# EAGLE design board_0.8v (EAGLE 7.7.0)
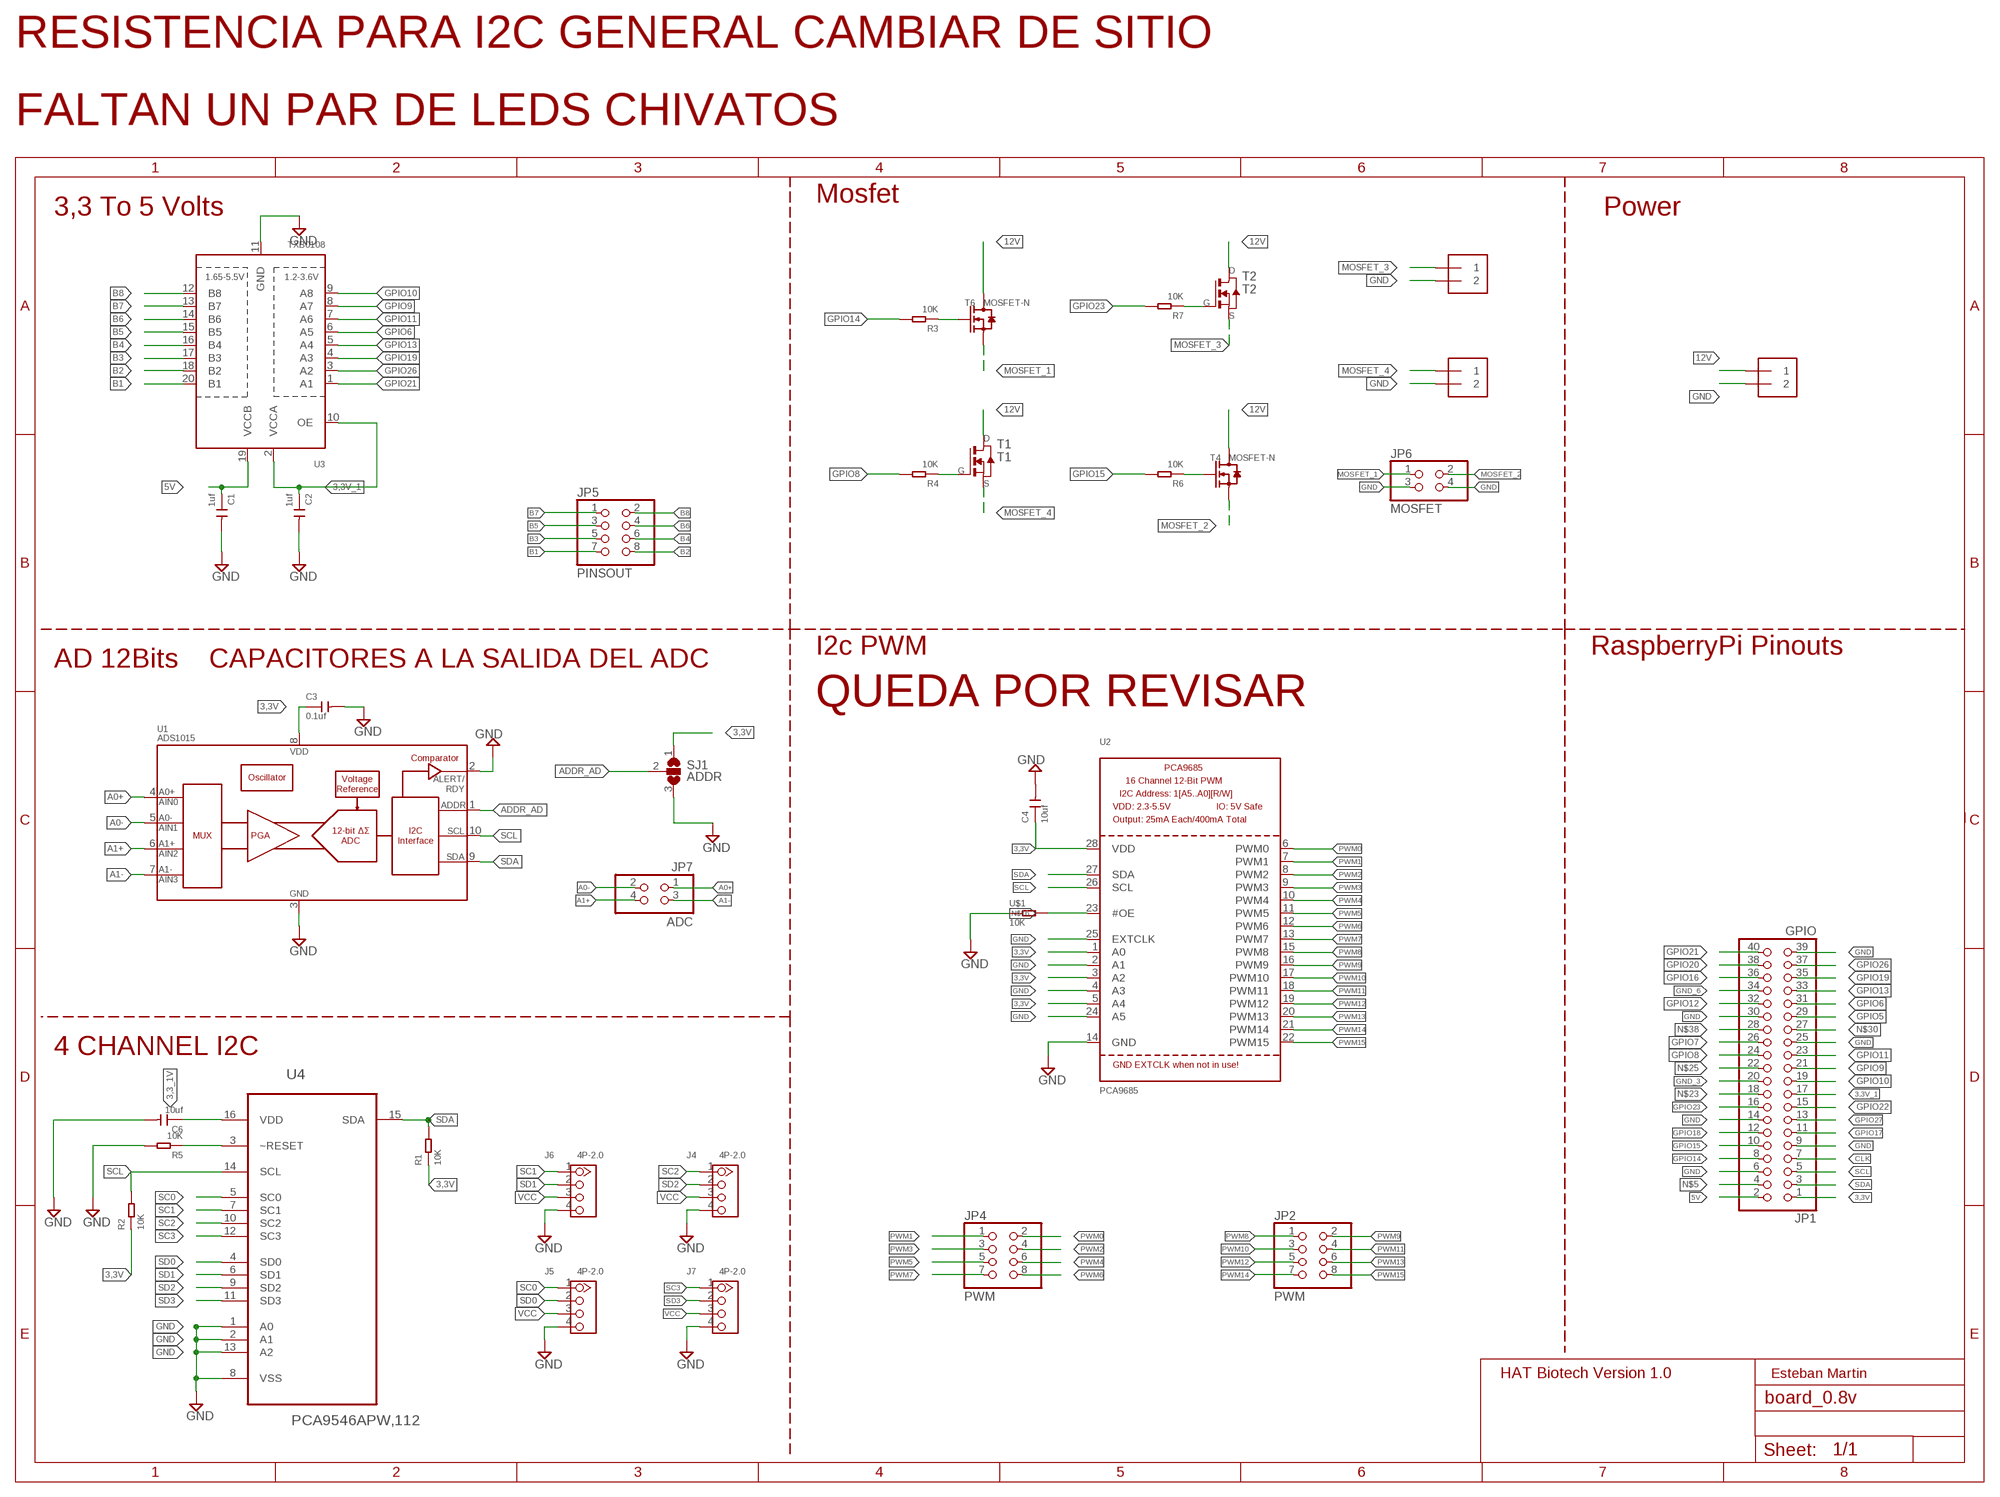
[diagram p0: schematic, sheet 1]

## Parts
C1  1uf  CERAMIC-1UF-25V-10%-X7R(0805)  [C0805]
C2  1uf  CERAMIC-1UF-25V-10%-X7R(0805)  [C0805]
C3  0.1uf  CERAMIC-1UF-25V-10%-X7R(0805)  [C0805]
C4  10uf  CERAMIC-1UF-25V-10%-X7R(0805)  [C0805]
C6  10uf  CERAMIC-1UF-25V-10%-X7R(0805)  [C0805]
J1  1X2-3.5MM  [1X2-3.5MM]
J2  1X2-3.5MM  [1X2-3.5MM]
J3  1X2-3.5MM  [1X2-3.5MM]
J4  4P-2.0  GROVE-CONNECTOR-DIP(4P-2.0)  [HW4-2.0]
J5  4P-2.0  GROVE-CONNECTOR-DIP(4P-2.0)  [HW4-2.0]
J6  4P-2.0  GROVE-CONNECTOR-DIP(4P-2.0)  [HW4-2.0]
J7  4P-2.0  GROVE-CONNECTOR-DIP(4P-2.0)  [HW4-2.0]
JP1  GPIO  PINHD-2X20  [2X20]
JP2  PWM  PINHD-2X4  [2X04]
JP4  PWM  PINHD-2X4  [2X04]
JP5  PINSOUT  PINHD-2X4  [2X04]
JP6  MOSFET  PINHD-2X2  [2X02]
JP7  ADC  PINHD-2X2  [2X02]
R1  10K  SMD-RES-10K-1%-1/8W(0805)  [R0805]
R2  10K  SMD-RES-10K-1%-1/8W(0805)  [R0805]
R3  10K  SMD-RES-10K-1%-1/8W(0805)  [R0805]
R4  10K  SMD-RES-10K-1%-1/8W(0805)  [R0805]
R5  10K  SMD-RES-10K-1%-1/8W(0805)  [R0805]
R6  10K  SMD-RES-10K-1%-1/8W(0805)  [R0805]
R7  10K  SMD-RES-10K-1%-1/8W(0805)  [R0805]
SJ1  ADDR  SJ2W  [SJ_2]
T1  T1  NMOSFETTO252  [TO252]
T2  T2  NMOSFETTO252  [TO252]
T4  MOSFET-N  [SOT-23]
T6  MOSFET-N  [SOT-23]
U1  ADS1015  [MSOP10]
U2  PCA9685  [TSSOP28]
U3  TXB0108  TXB0108PWR  [TSSOP20]
U4  PCA9546APW,112  [SOP65P640X110-16N]
U$1  10K  SMD-RES-10K-1%-1/8W(0805)  [R0805]

## Nets
3,3_1V: C6.1 U4.16(VDD)
3,3V: C3.1 C4.1 JP1.1 R1.1 R2.1 SJ1.1 U1.8(VDD) U2.1(A0) U2.3(A2) U2.5(A4) U2.28(VDD)
3,3V_1: C2.1 JP1.17 U3.2(VCCA) U3.10(OE)
5V: C1.1 JP1.2 U3.19(VCCB)
12V: J2.1 T1.3(D) T2.3(D) T4.3(D) T6.3(D)
A0+: JP7.1 U1.4(AIN0)
A0-: JP7.2 U1.5(AIN1)
A1+: JP7.4 U1.6(AIN2)
A1-: JP7.3 U1.7(AIN3)
ADDR_AD: SJ1.2 U1.1(ADDR)
B1: JP5.7 U3.20(B1)
B2: JP5.8 U3.18(B2)
B3: JP5.5 U3.17(B3)
B4: JP5.6 U3.16(B4)
B5: JP5.3 U3.15(B5)
B6: JP5.4 U3.14(B6)
B7: JP5.1 U3.13(B7)
B8: JP5.2 U3.12(B8)
CLK: JP1.7
GND: C1.2 C2.2 C3.2 C4.2 C6.2 J1.2 J2.2 J3.2 J4.4 J5.4 J6.4 J7.4 JP1.6 JP1.9 JP1.14 JP1.25 JP1.30 JP1.39 JP6.3 JP6.4 R5.2 SJ1.3 U1.2(ALERT/RDY) U1.3(VSS) U2.2(A1) U2.4(A3) U2.14(GND) U2.24(A5) U2.25(EXTCLK) U3.11(GND) U4.1(A0) U4.2(A1) U4.8(VSS) U4.13(A2) U$1.1
GND_3: JP1.20
GND_6: JP1.34
GPIO5: JP1.29
GPIO6: JP1.31 U3.6(A5)
GPIO7: JP1.26
GPIO8: JP1.24 R4.2
GPIO9: JP1.21 U3.8(A7)
GPIO10: JP1.19 U3.9(A8)
GPIO11: JP1.23 U3.7(A6)
GPIO12: JP1.32
GPIO13: JP1.33 U3.5(A4)
GPIO14: JP1.8 R3.2
GPIO15: JP1.10 R6.2
GPIO16: JP1.36
GPIO17: JP1.11
GPIO18: JP1.12
GPIO19: JP1.35 U3.4(A3)
GPIO20: JP1.38
GPIO21: JP1.40 U3.1(A1)
GPIO22: JP1.15
GPIO23: JP1.16 R7.2
GPIO26: JP1.37 U3.3(A2)
GPIO27: JP1.13
MOSFET_1: JP6.1 T6.2(S)
MOSFET_2: JP6.2 T4.2(S)
MOSFET_3: J1.1 T2.2(S)
MOSFET_4: J3.1 T1.2(S)
N$5: JP1.4
N$6: R3.1 T6.1(G)
N$7: R5.1 U4.3(~RESET)
N$9: R4.1 T1.1(G)
N$10: R6.1 T4.1(G)
N$11: R7.1 T2.1(G)
N$16: U2.23(#OE) U$1.2
N$23: JP1.18
N$25: JP1.22
N$30: JP1.27
N$38: JP1.28
PWM0: JP4.2 U2.6(PWM0)
PWM1: JP4.1 U2.7(PWM1)
PWM2: JP4.4 U2.8(PWM2)
PWM3: JP4.3 U2.9(PWM3)
PWM4: JP4.6 U2.10(PWM4)
PWM5: JP4.5 U2.11(PWM5)
PWM6: JP4.8 U2.12(PWM6)
PWM7: JP4.7 U2.13(PWM7)
PWM8: JP2.1 U2.15(PWM8)
PWM9: JP2.2 U2.16(PWM9)
PWM10: JP2.3 U2.17(PWM10)
PWM11: JP2.4 U2.18(PWM11)
PWM12: JP2.5 U2.19(PWM12)
PWM13: JP2.6 U2.20(PWM13)
PWM14: JP2.7 U2.21(PWM14)
PWM15: JP2.8 U2.22(PWM15)
SC0: J5.1 U4.5(SC0)
SC1: J6.1 U4.7(SC1)
SC2: J4.1 U4.10(SC2)
SC3: J7.1 U4.12(SC3)
SCL: JP1.5 R2.2 U1.10(SCL) U2.26(SCL) U4.14(SCL)
SD0: J5.2 U4.4(SD0)
SD1: J6.2 U4.6(SD1)
SD2: J4.2 U4.9(SD2)
SD3: J7.2 U4.11(SD3)
SDA: JP1.3 R1.2 U1.9(SDA) U2.27(SDA) U4.15(SDA)
VCC: J4.3 J5.3 J6.3 J7.3

## Notes on the sheet
- RESISTENCIA PARA I2C GENERAL CAMBIAR DE SITIO
- FALTAN UN PAR DE LEDS CHIVATOS
- Mosfet
- 3,3 To 5 Volts | Power
- I2c PWM | RaspberryPi Pinouts
- AD 12Bits | CAPACITORES A LA SALIDA DEL ADC
- QUEDA POR REVISAR
- 4 CHANNEL I2C
- HAT Biotech Version 1.0 | Esteban Martin

## Library data of the parts
C1 C2 = Seeed-OPL-Capacitor:CERAMIC-1UF-25V-10%-X7R(0805): 302010179; MPN: CC0805KKX7R8BB105
C3 C4 C6 = Seeed-OPL-Capacitor:CERAMIC-1UF-25V-10%-X7R(0805): 302010179; MPN: CC0805KKX7R8BB105; VALUE: 1uf
J1-J3 = adafruit:1X2: 3.5mm Terminal block http://www.ladyada.net/library/pcb/eaglelibrary.html
J4-J7 = Seeed-OPL-Connector:GROVE-CONNECTOR-DIP(4P-2.0): 320110033
JP1 = adafruit:PINHD-2X20: PIN HEADER
JP2 JP4 JP5 = adafruit:PINHD-2X4: PIN HEADER
JP6 JP7 = pinhead:PINHD-2X2: PIN HEADER
R1-R7 U$1 = Seeed-OPL-Resistor:SMD-RES-10K-1%-1/8W(0805): 301010361; MPN: RC0805FR-0710KL
SJ1 = jumper:SJ2W: SMD solder JUMPER
T1 T2 = fab_2:NMOSFET: MOS FET
T4 T6 = Seeed-OPL-Transistor:MOSFET-N
U1 = SparkFun-IC-Conversion:ADS1015: ADS1015 12-BIT ADC 12-Bit Del-Sig ADC Four single-ended inputs or two differential inputs Internal PGA I2C interface 2.0-5.5V SparkFun Products SparkFun Block for Intel Edison - ADC <https://www.sparkfun.com/products/13770> (DEV-13770); PROD_ID: IC-12270
U2 = adafruit:PCA9685: PCA9685 - 16 Channel 12-Bit I2C PWM Controller 5.0V tolerant 16 channel, 12-bit I2C PWM controller with 25mA per output (max. 400mA total) Digikey: 568-5931-1-ND
U3 = adafruit:TXB0108PWR: 8-Bit Bi-Directional Level Shifter 1.2V-3.6V (VCCA) to 1.65V-5.5V (VCCB) bi-directional level shifter with auto direction sensing. Max data rate - VCCA 1.8V: 20Mbps (50ns), VCCA 3.3V: 100Mbps (10ns) Digikey: 296-21527-1-ND
U4 = NXP_By_element14_Batch_1:PCA9546APW,112: 4-channel I2C-bus switch with reset; MPN: PCA9546APW,112; OC_FARNELL: 1831208; OC_NEWARK: 70R6610; PACKAGE: TSSOP-16; SUPPLIER: NXP

## Board
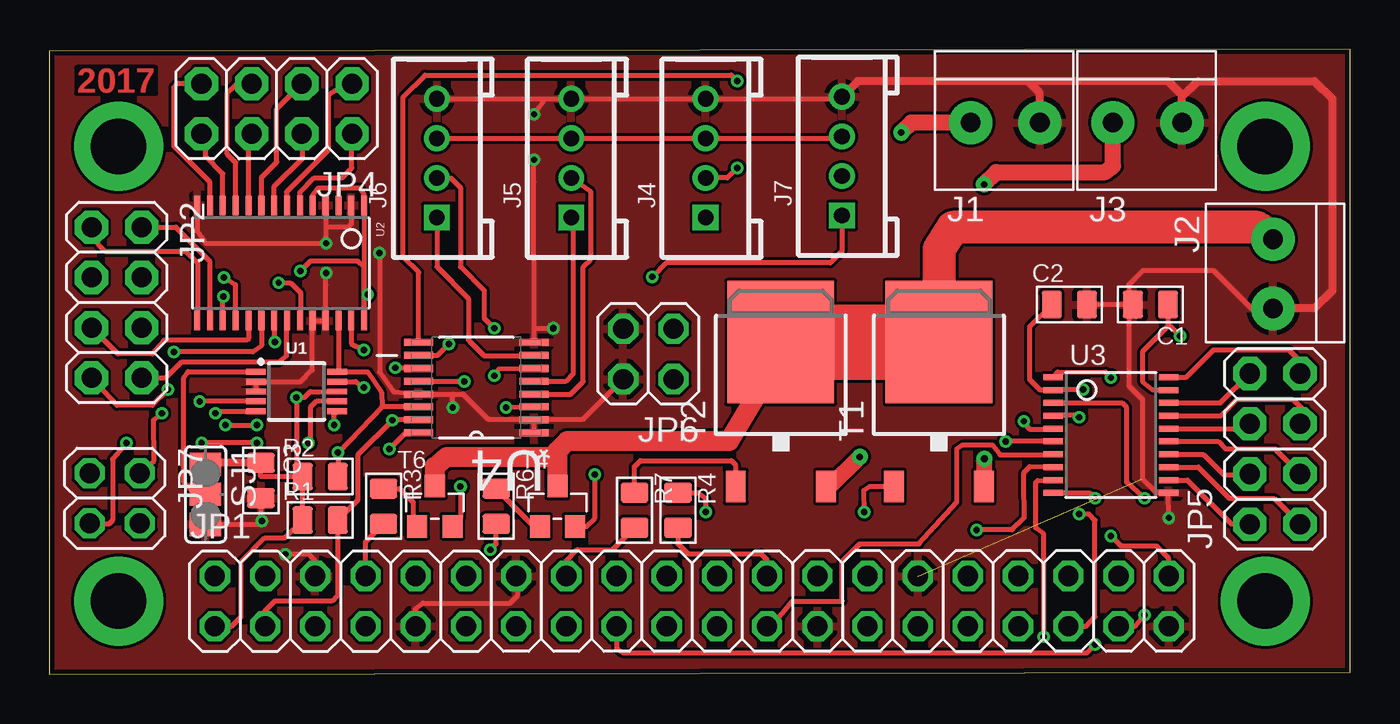
[diagram p1: board, top side]
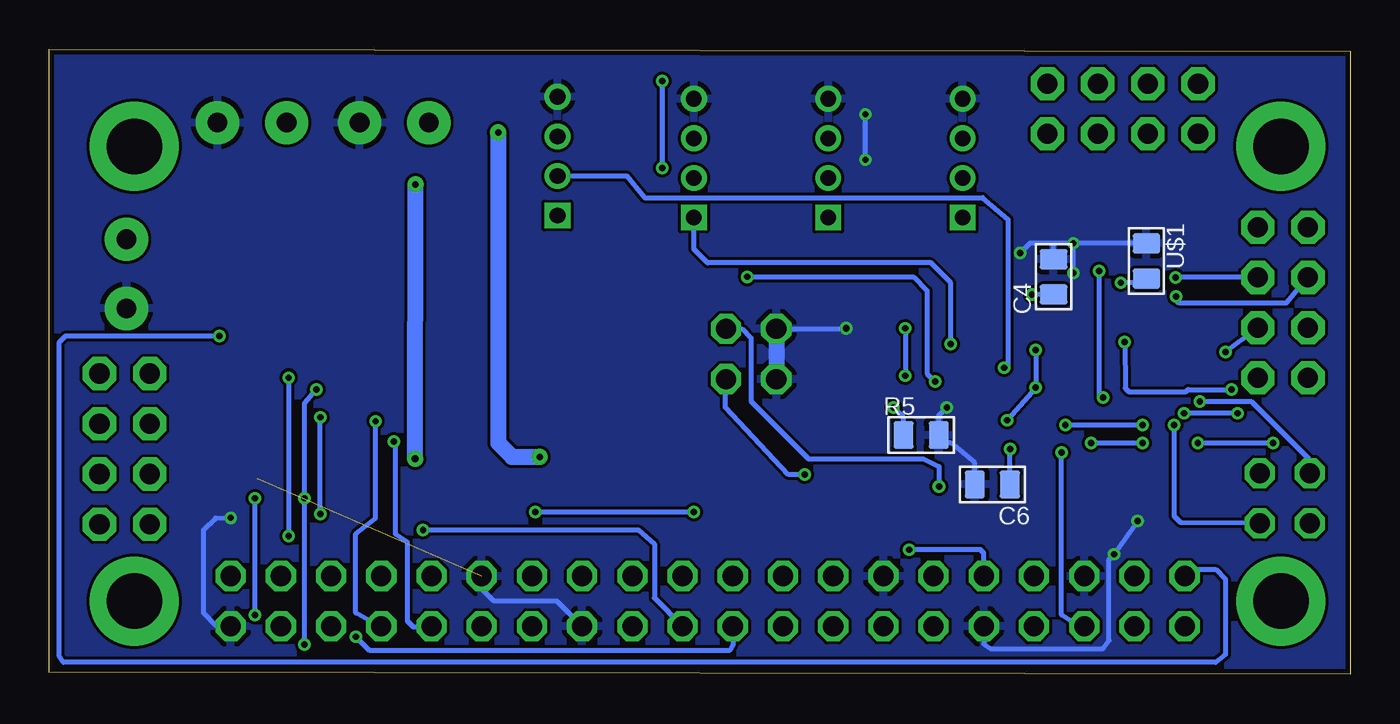
[diagram p2: board, bottom side, seen from below]

Size 65.8 x 31.6 mm. Coordinates in mm from the lower left corner, seen from the top.
Outline: 0,0 65.8,0.1 65.8,31.6 0,31.5 0,0
Copper layers (1*16): Top 0.035mm / dielectric 1.5mm / Bottom 0.035mm
Design rules "SeeedStudio_2layer_DRU_no_angle_20140221": minimum track width 6mil, minimum drill 12mil, track to track 6mil, track to pad 6mil, pad to pad 6mil, via to via 6mil, smd to smd 0mil, copper to edge 10mil, drill to drill 10mil, minimum pad ring 10mil, minimum via ring 6mil, stop-mask expansion 2mil, vias tented up to drill 100mil, thermal gap 10mil

### Footprints (pad centres in the part's own frame; a part is rotated, then mirrored left to right if it is on the bottom)
C0805 = smd 1.397 x 1.016: 1 0,0.889; 2 0,-0.889
1X2-3.5MM = drill 1 pad 2.184: 1 1.8,0; 2 -1.7,0
HW4-2.0 = drill 0.8 pad 1.27 square: 1 -3,0 | drill 0.8 pad 1.27: 2 -1,0; 3 1,0; 4 3,0
2X20 = drill 1.016 octagon: 1 -24.13,-1.27; 2 -24.13,1.27; 3 -21.59,-1.27; 4 -21.59,1.27; 5 -19.05,-1.27; 6 -19.05,1.27; 7 -16.51,-1.27; 8 -16.51,1.27; 9 -13.97,-1.27; 10 -13.97,1.27; 11 -11.43,-1.27; 12 -11.43,1.27; 13 -8.89,-1.27; 14 -8.89,1.27; 15 -6.35,-1.27; 16 -6.35,1.27; 17 -3.81,-1.27; 18 -3.81,1.27; 19 -1.27,-1.27; 20 -1.27,1.27; 21 1.27,-1.27; 22 1.27,1.27; 23 3.81,-1.27; 24 3.81,1.27; 25 6.35,-1.27; 26 6.35,1.27; 27 8.89,-1.27; 28 8.89,1.27; 29 11.43,-1.27; 30 11.43,1.27; 31 13.97,-1.27; 32 13.97,1.27; 33 16.51,-1.27; 34 16.51,1.27; 35 19.05,-1.27; 36 19.05,1.27; 37 21.59,-1.27; 38 21.59,1.27; 39 24.13,-1.27; 40 24.13,1.27
2X04 = drill 1.016 pad 1.676 octagon: 1 -3.81,-1.27; 2 -3.81,1.27; 3 -1.27,-1.27; 4 -1.27,1.27; 5 1.27,-1.27; 6 1.27,1.27; 7 3.81,-1.27; 8 3.81,1.27
2X02 = drill 1.016 octagon: 1 -1.27,-1.27; 2 -1.27,1.27; 3 1.27,-1.27; 4 1.27,1.27
R0805 = smd 1.397 x 1.016: 1 0,0.889; 2 0,-0.889
SJ_2 = smd 1.168 x 1.6: 1 -1.524,0; 2 0,0; 3 1.524,0
TO252 = smd 1 x 1.6: 1 -2.28,-4.8; 2 2.28,-4.8 | smd 5.4 x 6.2: 3 0,2.5
SOT-23 = smd 1.016 x 1.143: 1 -0.889,-1.016; 2 0.889,-1.016; 3 0,1.016
MSOP10 = smd 0.3 x 1: 1 -1,-2.05; 2 -0.5,-2.05; 3 0,-2.05; 4 0.5,-2.05; 5 1,-2.05; 6 1,2.05; 7 0.5,2.05; 8 0,2.05; 9 -0.5,2.05; 10 -1,2.05
TSSOP28 = smd 0.305 x 0.991: 1 -4.225,-2.918; 2 -3.575,-2.918; 3 -2.925,-2.918; 4 -2.275,-2.918; 5 -1.625,-2.918; 6 -0.975,-2.918; 7 -0.325,-2.918; 8 0.325,-2.918; 9 0.975,-2.918; 10 1.625,-2.918; 11 2.275,-2.918; 12 2.925,-2.918; 13 3.575,-2.918; 14 4.225,-2.918; 15 4.225,2.918; 16 3.575,2.918; 17 2.925,2.918; 18 2.275,2.918; 19 1.625,2.918; 20 0.975,2.918; 21 0.325,2.918; 22 -0.325,2.918; 23 -0.975,2.918; 24 -1.625,2.918; 25 -2.275,2.918; 26 -2.925,2.918; 27 -3.575,2.918; 28 -4.225,2.918
TSSOP20 = smd 0.305 x 0.991: 1 -2.925,-2.918; 2 -2.275,-2.918; 3 -1.625,-2.918; 4 -0.975,-2.918; 5 -0.325,-2.918; 6 0.325,-2.918; 7 0.975,-2.918; 8 1.625,-2.918; 9 2.275,-2.918; 10 2.925,-2.918; 11 2.925,2.918; 12 2.275,2.918; 13 1.625,2.918; 14 0.975,2.918; 15 0.325,2.918; 16 -0.325,2.918; 17 -0.975,2.918; 18 -1.625,2.918; 19 -2.275,2.918; 20 -2.925,2.918
SOP65P640X110-16N = smd 1.473 x 0.356: 1 -2.921,2.286; 2 -2.921,1.626; 3 -2.921,0.965; 4 -2.921,0.33; 5 -2.921,-0.33; 6 -2.921,-0.965; 7 -2.921,-1.626; 8 -2.921,-2.286; 9 2.921,-2.286; 10 2.921,-1.626; 11 2.921,-0.965; 12 2.921,-0.33; 13 2.921,0.33; 14 2.921,0.965; 15 2.921,1.626; 16 2.921,2.286

### Placement (x,y rotation side)
C1  55.7,18.7 270 top
C2  51.6,18.7 90 top
C3  10.7,9.8 0 top
C4  15,20.1 180 bottom
C6  18.1,9.6 270 bottom
J1  48.4,27.9 180 top
J2  61.9,20.2 90 top
J3  55.6,27.9 180 top
J4  33.2,26.1 90 top
J5  26.4,26.1 90 top
J6  19.6,26.1 90 top
J7  40.1,26.2 90 top
JP1  32.5,3.7 0 top
JP2  3.4,18.8 270 top
JP4  11.5,28.6 180 top
JP5  62,11.4 90 top
JP6  30.3,16.2 180 top
JP7  3.3,8.9 270 top
R1  13.7,7.8 90 top
R2  13.7,10 90 top
R3  16.9,8.5 0 top
R4  31.8,8.3 0 top
R5  21.7,12.1 90 bottom
R6  22.6,8.5 0 top
R7  29.6,8.3 0 top
SJ1  7.9,9.1 270 top
T1  45,14.3 0 top
T2  37,14.3 0 top
T4  25.7,8.5 0 top
T6  19.5,8.5 0 top
U1  12.5,14.3 270 top
U2  11.7,20.8 180 top
U3  53.7,12.1 270 top
U4  21.6,14.5 180 top
U$1  10.3,20.9 0 bottom

### Tracks (layer width: path | path; a pad name or v marks a point on that pad's centre or on a via)
3,3_1V  (via drill 0.32)
  Top 0.254: v17.2,11.4 18.01,12.21 U4.16
  Bottom 0.254: C6.1 17.21,11.11 v17.2,11.4
3,3V  (via drill 0.32)
  Top 0.254: R2.1 10.69,10 C3.1 | R2.1 R1.1 11.91,6.9 10.9,6.9 9.7,5.7 9.7,2.9 9.23,2.43 JP1.1 8.34,2.4 | R2.1 12.5,10.01 v12.5,14 12.9,14 13.2,14.3 U1.8 | U2.5 13.33,24.23 13.6,24.6 14.7,24.6 | 14.7,24.6 15.7,24.6 15.9,24.3 15.9,23.74 U2.1 U2.28 | U2.3 14.62,24.48 14.7,24.6 | U2.28 15.92,20.58 15.6,20.9 13.2,20.9 v12.7,20.4 | 16.1,19.1 v16.1,19.2 15.92,19.03 U2.28
  Top 0.406: C3.1 7.9,10.69 SJ1.1
  Bottom 0.254: v12.7,20.4 12.7,14 v12.5,14 | C4.1 15.69,19.21 v16.1,19.2
3,3V_1  (via drill 0.32)
  Top 0.254: JP1.17 28.69,1.31 29,1.1 52.5,1.1 v52.9,1.5 | v52.3,14.4 50.86,14.4 U3.2 50.12,14.38 49.6,14.9 49.6,17.59 C2.1 50.61,18.8 | U3.10 52.62,9.17 v52.9,8.9
  Bottom 0.254: v52.9,1.5 v52.9,8.9 52.9,13.7 v52.3,14.4
5V  (via drill 0.32)
  Top 0.254: C1.1 56.59,17.59 | 56.59,17.59 55.3,16.3 55.3,14.8 55.8,14.4 56.54,14.4 U3.19 | 56.59,17.59 56.71,17.59 v57.2,17.1
  Bottom 0.254: JP1.2 8.04,5.3 6.8,5.3 6.3,4.8 6.3,1 6.8,0.6 65.1,0.6 65.3,0.9 65.3,16.8 65,17.1 v57.2,17.1
12V
  Top 0.254: 25.7,11 25.7,11.3 | 36.5,15.3 36.2,15.3 36.7,15.4 T2.3
  Top 1.016: T6.3 19.5,10.5 20.1,11 25.7,11 T4.3 | 25.7,11.3 26.2,11.8 34.4,11.8 36.5,15.3
  Top 1.676: J2.1 61.1,22.6 45.7,22.6 45,21.5 T1.3
  Top 3.81: T2.3 T1.3
A0+  (via drill 0.32 pad 0.25)
  Top 0.254: U1.4 v7.6,13.8
  Bottom 0.254: v7.6,13.8 5,13.8 2.1,10.9 2.1,10.1 JP7.1
A0-  (via drill 0.32 pad 0.25)
  Top 0.254: JP7.2 5.3,10.8 5.27,12.87 v5.7,13.2 | v8.4,13.2 8.6,13.3 U1.5
  Bottom 0.254: v5.7,13.2 v8.4,13.2
A1+  (via drill 0.32 pad 0.25)
  Top 0.254: v8.9,12.6 v10.5,12.6 | v14.4,12.6 14.4,13.15 U1.6 14.6,13.3
  Bottom 0.254: JP7.4 8.57,7.67 8.9,8 v8.9,12.6 | v10.5,12.6 v14.4,12.6
A1-  (via drill 0.32 pad 0.25)
  Top 0.254: U1.7 13.5,13.8 13.2,13.5 13.2,11.7 v13.1,11.7 | v10.5,11.7 v7.7,11.7 | v3.9,11.7 3.2,10.9 3.2,7.8 3,7.6 2.06,7.6 JP7.3
  Bottom 0.254: v13.1,11.7 v10.5,11.7 | v7.7,11.7 v3.9,11.7
ADDR_AD
  Top 0.254: U1.1 7.5,15.3 7.01,15.31 6.8,15 6.8,9.7 7.4,9.1 SJ1.2
B1
  Top 0.254: U3.20 57.52,15.03 58.9,16.4 62.7,16.4 63.3,15.8 63.3,15.24 JP5.7
B2
  Top 0.254: U3.18 59.24,13.72 JP5.8
B3
  Top 0.254: U3.17 59.27,13.07 60.1,13.9 62.9,13.9 63.4,13.4 63.4,12.8 JP5.5
B4
  Top 0.254: U3.16 60.48,12.42 JP5.6
B5
  Top 0.254: U3.15 59.12,11.78 59.5,11.4 62,11.4 JP5.3
B6
  Top 0.254: U3.14 58.38,11.12 59.4,10.1 60.7,10.1 JP5.4
B7
  Top 0.254: U3.13 58.12,10.47 59.7,8.9 61.96,8.9 JP5.1
B8
  Top 0.254: U3.12 57.57,9.82 59.81,7.59 JP5.2
GND  (via drill 0.32, 0.33)  (1 unrouted)
  Top 0.254: U1.3 U1.2 12.7,14.8 13.3,15.4 13.3,17.86 U2.24 U2.25 13.97,19.68 v14,20.3 | U4.1 U4.2 24.49,12.9 | J6.4 25.1,29.1 | 25.1,29.1 J5.4 J4.4 40.1,29.1 J7.4 | C1.2 C2.2 | J2.2 60.8,18.5 58.9,20.4 55.3,20.4 54.6,19.7 54.6,18.5 | 54.6,18.5 55,18.1 | 10.79,7.7 v10.75,7.74 | v10.75,7.74 10.7,7.8 C3.2 | JP1.6 13.4,5.8 13.13,6.07 v11.93,6.07 | U4.8 24.52,17.5 | 24.52,17.5 24.5,24.9 24.5,26 v24.52,26.02 | v24.52,28.32 25.1,29.1 | 20.4,14.17 U4.13 18.65,14.2 17.4,14.3 16.7,15.3 v16.7,21.3 | 20.4,14.17 20.93,14.17 22.2,12.9 24.49,12.9 | 54.6,18.5 54.6,14.6 55.3,13.9 55.3,9.9 55.9,9.3 | 55.9,9.3 55.99,9.2 U3.11 v56.63,7.91 | U2.14 7.47,22.43 7.9,21.8 v14,21.8 13.97,21.73 13.97,22.7 | U2.4 13.97,22.7 | U2.2 15.28,22.78 15.1,22.6 14.08,22.6 13.97,22.7 | 55.9,9.3 56,9.2 56.7,9.2 | JP1.14 23.7,4.88 23.7,4 23.3,3.6 18.9,3.6 18.5,3.3 18.5,2.5 JP1.9 | 24.52,17.5 25.2,17.5 v25.5,17.5 | 24.49,12.9 27,12.9 JP6.4 | SJ1.3 10.58,7.58 v10.75,7.74 | v20.4,13.5 20.4,14.17
  Top 0.406: 49.5,30 56.6,30 57.3,29.3 J3.2 57.3,29.2 58.1,30 64,30 64.9,29.1 64.9,19.4 64,18.5 J2.2 | 49.5,30 40.9,30 J7.4 | J1.2 50.1,29.4 49.5,30
  Bottom 0.254: v10.75,7.74 v11.93,6.07 12.2,5.8 12.2,1.7 12.5,1.3 18.2,1.3 18.53,1.53 JP1.9 | v24.52,26.02 v24.52,28.32 | v14,21.8 15,21.8 | 15,21.8 16.2,21.8 v16.7,21.3 | v14,20.3 v14,21.8 | JP1.39 57.33,2.43 58,3.1 58,7.3 57.4,7.9 v56.63,7.91 | JP6.3 25.53,17.47 v25.5,17.5 | U$1.1 v14,21.8 | C4.2 15,21.8 | v20.4,13.5 20.81,13.09 R5.2 20.41,11.7 20.2,11.7 18.99,10.69 C6.2 | JP1.25 40.12,3.7 43.3,3.7 43.93,4.33 JP1.30
  Bottom 0.813: JP6.3 JP6.4
  pour Bottom: 0,31.8 66.3,32 66.3,-0.3 -0.2,0
  pour Top: 0,31.8 66.2,31.9 66.2,-0.3 -0.3,-0.4
GPIO6  (via drill 0.32)
  Top 0.254: U3.6 v48.38,11.78
  Bottom 0.254: v48.38,11.78 48.3,11.7 48.3,7.1 47.7,6.7 47.7,2.7 47.4,2.4 46.5,2.4 JP1.31
GPIO8
  Top 0.254: R4.2 31.8,6.6 32.3,6.1 36,6.1 36.3,5.8 JP1.24
GPIO9  (via drill 0.32)
  Top 0.254: U3.8 49.6,10.5 49.27,10.17 49.27,9.78 49.3,7.9 48.7,7.3 v46.9,7.3
  Bottom 0.254: v46.9,7.3 36,7.3 35.2,6.6 35.2,3.86 JP1.21
GPIO10  (via drill 0.32)
  Top 0.254: v50.3,1.9 50.3,7.1 49.9,7.4 49.9,9.7 50,9.8 U3.9
  Bottom 0.254: JP1.19 31.23,1.47 31.4,1.2 49.6,1.2 v50.3,1.9
GPIO11
  Top 0.254: JP1.23 36.53,2.43 37.6,3.7 40.1,3.7 40.1,5.7 41,6.6 44,6.6 45.9,8.7 45.9,11.4 46.2,11.6 47.7,11.6 48.1,11.1 50.76,11.1 U3.7
GPIO13  (via drill 0.32)
  Top 0.254: v49.3,12.8 49.3,12.7 49.6,12.4 50.76,12.4 U3.5
  Bottom 0.254: JP1.33 49.13,2.43 50.3,3.1 50.3,7.1 49.3,7.9 v49.3,12.8
GPIO14
  Top 0.254: JP1.8 15.99,6.7 R3.2
GPIO15  (via drill 0.32)
  Top 0.254: v22.3,6.3 22.6,6.6 R6.2
  Bottom 0.254: JP1.10 18.53,6.13 18.7,6.3 v22.3,6.3
GPIO19  (via drill 0.32)
  Top 0.254: JP1.35 52.47,2.43 52.9,2.9 52.9,7.8 52.6,8.1 v52.1,8.1 | v52.1,13 52,13.1 50.81,13.1 U3.4
  Bottom 0.254: v52.1,8.1 v52.1,13
GPIO21  (via drill 0.32)
  Top 0.254: U3.1 50.82,15.03 51,15.3 53.42,15.28 v53.7,15 | v53.7,7 54.2,6.5 56,6.5 56.6,5.9 56.6,5 JP1.40
  Bottom 0.254: v53.7,15 v53.7,7
GPIO23
  Top 0.254: JP1.16 26.15,5.75 26.7,6.3 28.49,6.3 R7.2
GPIO26  (via drill 0.32)
  Top 0.254: JP1.37 54.93,2.43 v55.4,3 | v55.4,8.9 54.5,9.7 54.5,13.5 54.3,13.7 50.81,13.7 U3.3
  Bottom 0.254: v55.4,3 v55.4,8.9
MOSFET_1  (via drill 0.33)
  Top 0.254: v20.8,9.5 20.8,7.89 T6.2
  Bottom 0.254: JP6.1 30.77,17.47 30.3,17 30.3,13.8 27.4,10.9 21.6,10.9 20.8,10.5 v20.8,9.5
MOSFET_2  (via drill 0.33)
  Top 0.254: T4.2 27.18,7.48 27.6,7.9 v27.6,10.1
  Bottom 0.254: v27.6,10.1 28.4,10.1 31.6,13.5 31.6,14.7 JP6.2
MOSFET_3  (via drill 0.33 pad 0.81)
  Top 0.254: 39.48,9.5 T2.2
  Top 0.813: J1.1 43.6,27.9 v43.1,27.4 | v41,11 39.48,9.5
  Bottom 0.813: v43.1,27.4 43.1,11.7 42.4,11 v41,11
MOSFET_4  (via drill 0.33 pad 0.81)
  Top 0.813: T1.2 v47.3,10.9 | v47.28,24.78 47.9,25.4 53.4,25.4 53.8,25.7 J3.1
  Bottom 0.813: v47.3,10.9 v47.28,24.78
N$1  (via drill 2.8 pad 4.5)
  other vias: 61.5,26.7
N$2  (via drill 2.8 pad 4.5)
  other vias: 3.5,26.7
N$3  (via drill 2.8 pad 4.5)
  other vias: 3.5,3.7
N$4  (via drill 2.8 pad 4.5)
  other vias: 61.5,3.7
N$6
  Top 0.254: R3.1 17.71,9.39 18.4,8.7 18.4,7.7 T6.1
N$7  (via drill 0.32)
  Top 0.254: v23.1,13.5 U4.3
  Bottom 0.254: R5.1 22.6,13 v23.1,13.5
N$9  (via drill 0.32)
  Top 0.254: R4.1 32.81,9.19 33.2,8.9 v33.2,8.2 | v41.22,8.2 41.2,9.3 41.5,9.5 T1.1
  Bottom 0.254: v33.2,8.2 v41.22,8.2
N$10
  Top 0.254: T4.1 24.5,7.48 R6.1
N$11
  Top 0.254: R7.1 29.6,10.5 29.9,10.8 34.5,10.8 34.7,10.6 34.7,9.52 T2.1
N$16  (via drill 0.32)
  Top 0.254: v11.6,19.8 12.2,19.8 12.7,19.3 12.7,17.91 U2.23
  Bottom 0.254: U$1.2 10.5,19.8 v11.6,19.8
PWM0
  Top 0.254: U2.6 12.68,24.38 13.4,25.1 14.8,25.1 15.3,25.6 15.3,25.64 JP4.2
PWM1
  Top 0.254: JP4.1 14.37,29.47 14.1,29.3 14.1,26.5 12,24.4 12,23.99 U2.7
PWM2
  Top 0.254: U2.8 11.38,24.68 12.8,26.1 12.8,27.3 JP4.4
PWM3
  Top 0.254: U2.9 10.72,25.12 11.5,25.9 11.5,28.6 JP4.3
PWM4
  Top 0.254: U2.10 10.08,27.18 JP4.6
PWM5
  Top 0.254: U2.11 9.43,25.88 9,26.3 9,29.4 9.4,29.8 10.16,29.8 JP4.5
PWM6
  Top 0.254: U2.12 8.78,25.33 7.9,26.2 7.9,27.12 JP4.8
PWM7
  Top 0.254: U2.13 8.12,24.88 6.3,26.7 6.3,29.7 6.5,29.9 7.66,29.9 JP4.7
PWM8
  Top 0.254: JP2.1 2.13,22.07 2.8,21.4 6.9,21.4 7.5,20.8 7.5,17.91 U2.15
PWM9
  Top 0.254: JP2.2 6.39,22.61 8.1,20.9 8.1,17.91 U2.16
PWM10  (via drill 0.32)
  Top 0.254: U2.17 8.78,18.93 v8.8,19.1
  Bottom 0.254: v8.8,19.1 8.8,18.9 8.7,18.8 3.2,18.8 JP2.3
PWM11  (via drill 0.32)
  Top 0.254: v8.83,20.07 9.4,19.7 9.4,17.91 U2.18
  Bottom 0.254: JP2.4 v8.83,20.07
PWM12
  Top 0.254: U2.19 10.08,16.98 10,16.9 5.8,16.9 5.2,16.2 3.46,16.2 JP2.5
PWM13  (via drill 0.32)
  Top 0.254: U2.20 10.72,16.62 10.3,16.3 v6.3,16.3
  Bottom 0.254: v6.3,16.3 JP2.6
PWM14  (via drill 0.32)
  Top 0.254: U2.21 11.38,16.83 v11.4,16.8 | v6,14.4 5.2,13.6 3.42,13.6 JP2.7
  Bottom 0.254: v11.4,16.8 11.38,14.47 11.2,14.3 8.3,14.3 8.2,14.4 v6,14.4
PWM15
  Top 0.254: JP2.8 5.89,14.99 6.7,15.8 11.6,15.8 12,16.1 12,17.71 U2.22
SC0
  Top 0.254: J5.1 26.4,22.7 26.5,22.4 26.5,15.2 26.1,14.8 24.15,14.8 U4.5
SC1
  Top 0.254: J6.1 19.6,20.6 21.2,19 21.2,16.9 22,16.1 24.49,16.1 U4.7
SC2  (via drill 0.32 pad 0.25)
  Top 0.254: U4.10 19.63,16.13 v20.2,16.7
  Bottom 0.254: v20.2,16.7 20.2,19.8 21.2,20.8 32.5,20.8 33.2,21.5 J4.1
SC3  (via drill 0.32 pad 0.25, 0.33 pad 0.25)
  Top 0.254: J7.1 40.1,21.4 39.5,20.8 31.2,20.8 v30.5,20.1 | v21,14.8 18.71,14.8 U4.12
  Bottom 0.254: v30.5,20.1 22.1,20.1 21.4,19.4 21.4,15.2 v21,14.8
SCL  (via drill 0.32 pad 0.26)
  Top 0.254: v14.6,11.2 v14.6,11.21 | v14.6,11.21 R2.2 | U4.14 16.82,13.54 | 16.82,13.54 v14.6,11.21 | 16.82,13.54 16.8,14.26 16.1,15.3 U1.10 14.62,15.38 U2.26
  Bottom 0.254: JP1.5 13.73,2.43 14.6,3 v14.6,11.21
SD0
  Top 0.254: U4.4 26.37,14.17 27,14.8 27,20.6 27.4,21 27.4,24.4 J5.2
SD1  (via drill 0.32 pad 0.25)
  Top 0.254: J6.2 20.3,25.1 20.8,24.6 20.8,20.6 22,19.4 22,18 v22.5,17.5 | v22.5,15.1 22.74,15.45 U4.6
  Bottom 0.254: v22.5,17.5 v22.5,15.1
SD2  (via drill 0.32)
  Top 0.254: U4.9 18.68,20.32 17.9,21.1 17.9,29.2 19,30.3 34.5,30.3 v34.8,30 | v34.8,25.6 34.3,25.1 J4.2
  Bottom 0.254: v34.8,30 v34.8,25.6
SD3  (via drill 0.32 pad 0.25)
  Top 0.254: v17.5,15.5 18.6,15.5 | 18.6,15.5 18.64,15.5 | 18.64,15.5 U4.11 | U4.11 18.83,15.46 18.9,15.4 18.7,15.4 | 18.7,15.4 18.6,15.4 18.6,15.5 | 18.64,15.5 18.7,15.5 18.7,15.4 | U4.11 18.68,15.42 18.7,15.4
  Bottom 0.254: J7.2 36.6,25.2 35.7,24.1 18.6,24.1 17.3,23 17.3,15.6 v17.5,15.5
SDA  (via drill 0.32, 0.32 pad 0.25, 0.33)
  Top 0.254: JP1.3 10.9,3.2 11.4,3.7 14.3,3.7 14.59,3.99 R1.2 15.6,8.81 15.6,11.1 v17.35,12.85 17.37,12.87 U4.15 | U1.9 15.5,14.8 v15.9,14.5 | U2.27 15.28,16.73 v15.9,16.4
  Bottom 0.254: v17.35,12.85 17.3,12.9 v15.9,14.5 v15.9,16.4
VCC
  Top 0.254: J6.3 J5.3 J4.3 40.1,27.1 J7.3

### Text on the board
Top: 2017
Name: HAT-BIOTECH 0.8v | nanusefue@gmail.com